# EAGLE design HM_EX_DS18B20 (EAGLE 9.2.2)
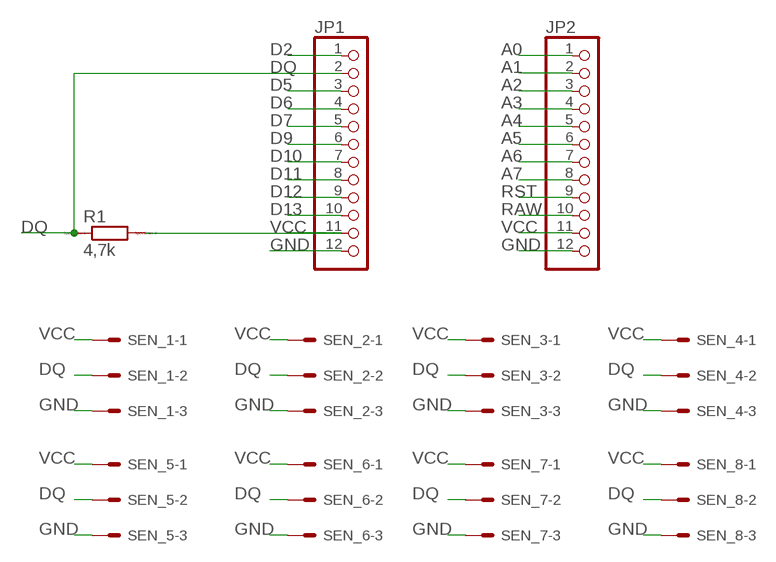
[diagram p0: schematic, sheet 1]

## Parts
JP1  PINHD-1X12  [1X12]
JP2  PINHD-1X12  [1X12]
R1  4,7k  R0207/10  [0207/10]
SEN_1  22-27-2031-03  [6410-03]
SEN_2  22-27-2031-03  [6410-03]
SEN_3  22-27-2031-03  [6410-03]
SEN_4  22-27-2031-03  [6410-03]
SEN_5  22-27-2031-03  [6410-03]
SEN_6  22-27-2031-03  [6410-03]
SEN_7  22-27-2031-03  [6410-03]
SEN_8  22-27-2031-03  [6410-03]

## Nets
A0: JP2.1
A1: JP2.2
A2: JP2.3
A3: JP2.4
A4: JP2.5
A5: JP2.6
A6: JP2.7
A7: JP2.8
D2: JP1.1
D5: JP1.3
D6: JP1.4
D7: JP1.5
D9: JP1.6
D10: JP1.7
D11: JP1.8
D12: JP1.9
D13: JP1.10
DQ: JP1.2 R1.1 SEN_1.2 SEN_2.2 SEN_3.2 SEN_4.2 SEN_5.2 SEN_6.2 SEN_7.2 SEN_8.2
GND: JP1.12 JP2.12 SEN_1.3 SEN_2.3 SEN_3.3 SEN_4.3 SEN_5.3 SEN_6.3 SEN_7.3 SEN_8.3
RAW: JP2.10
RST: JP2.9
VCC: JP1.11 JP2.11 R1.2 SEN_1.1 SEN_2.1 SEN_3.1 SEN_4.1 SEN_5.1 SEN_6.1 SEN_7.1 SEN_8.1

## Library data of the parts
JP1 JP2 = adafruit:PINHD-1X12: PIN HEADER
R1 = eagle-ltspice:R: RESISTOR, European symbol; SPICEMODEL: NONE; SPICEPREFIX: R
SEN_1-SEN_8 = con-molex:22-?-03: CONNECTOR wire to board 2.54 mm (.1 inch) pitch header; MF: MOLEX; OC_FARNELL: unknown; OC_NEWARK: unknown

## Board
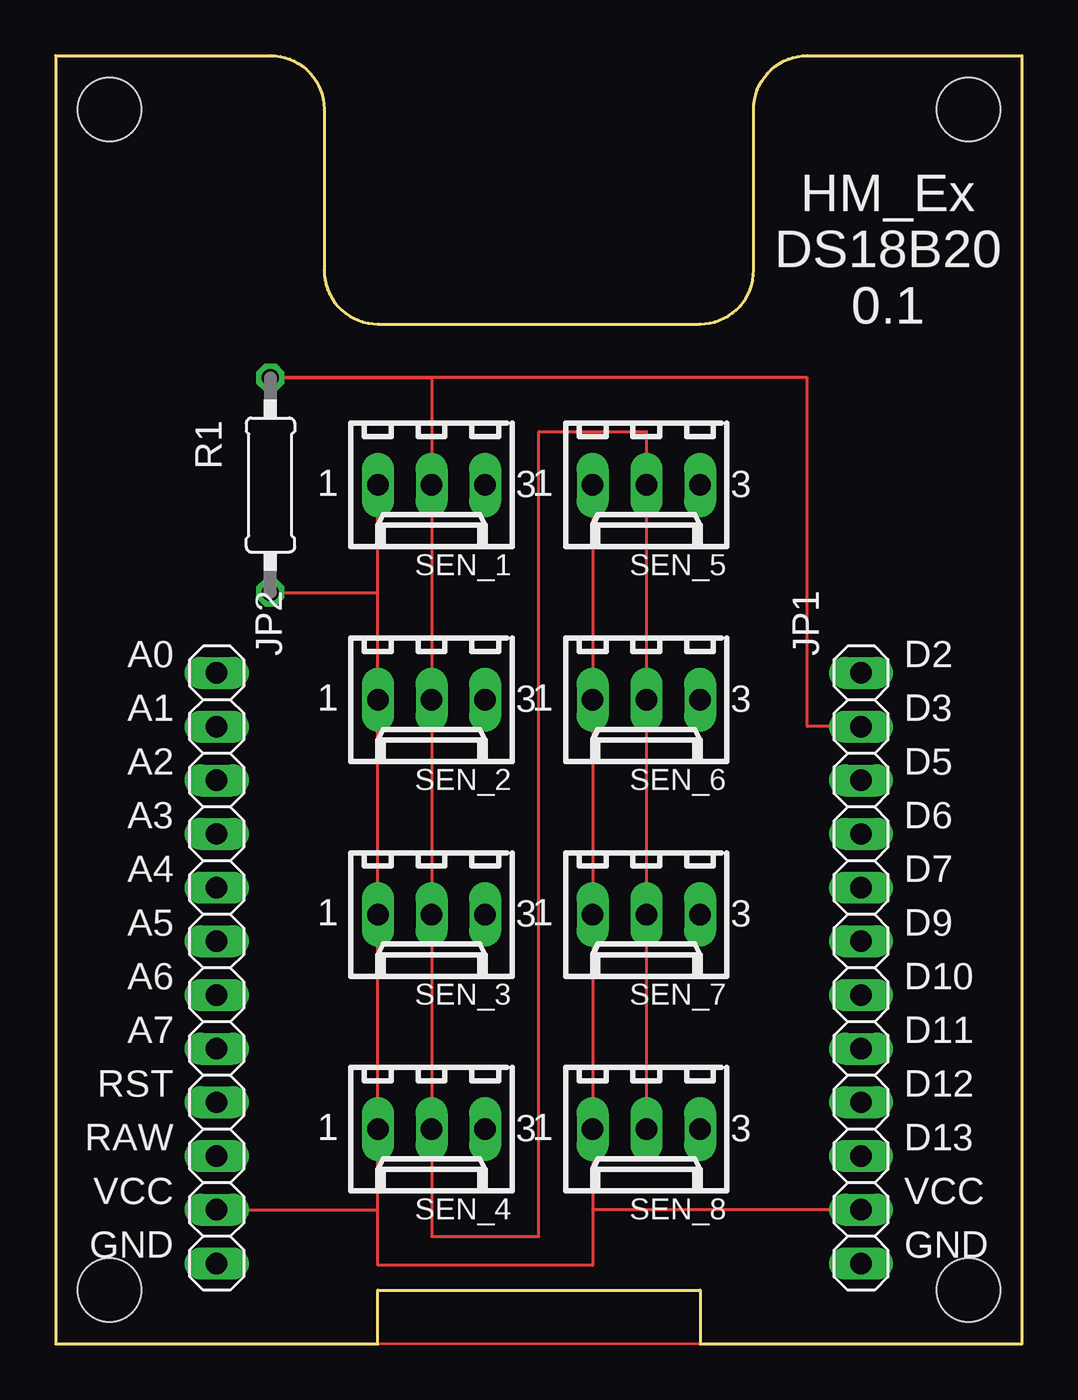
[diagram p1: board, top side]
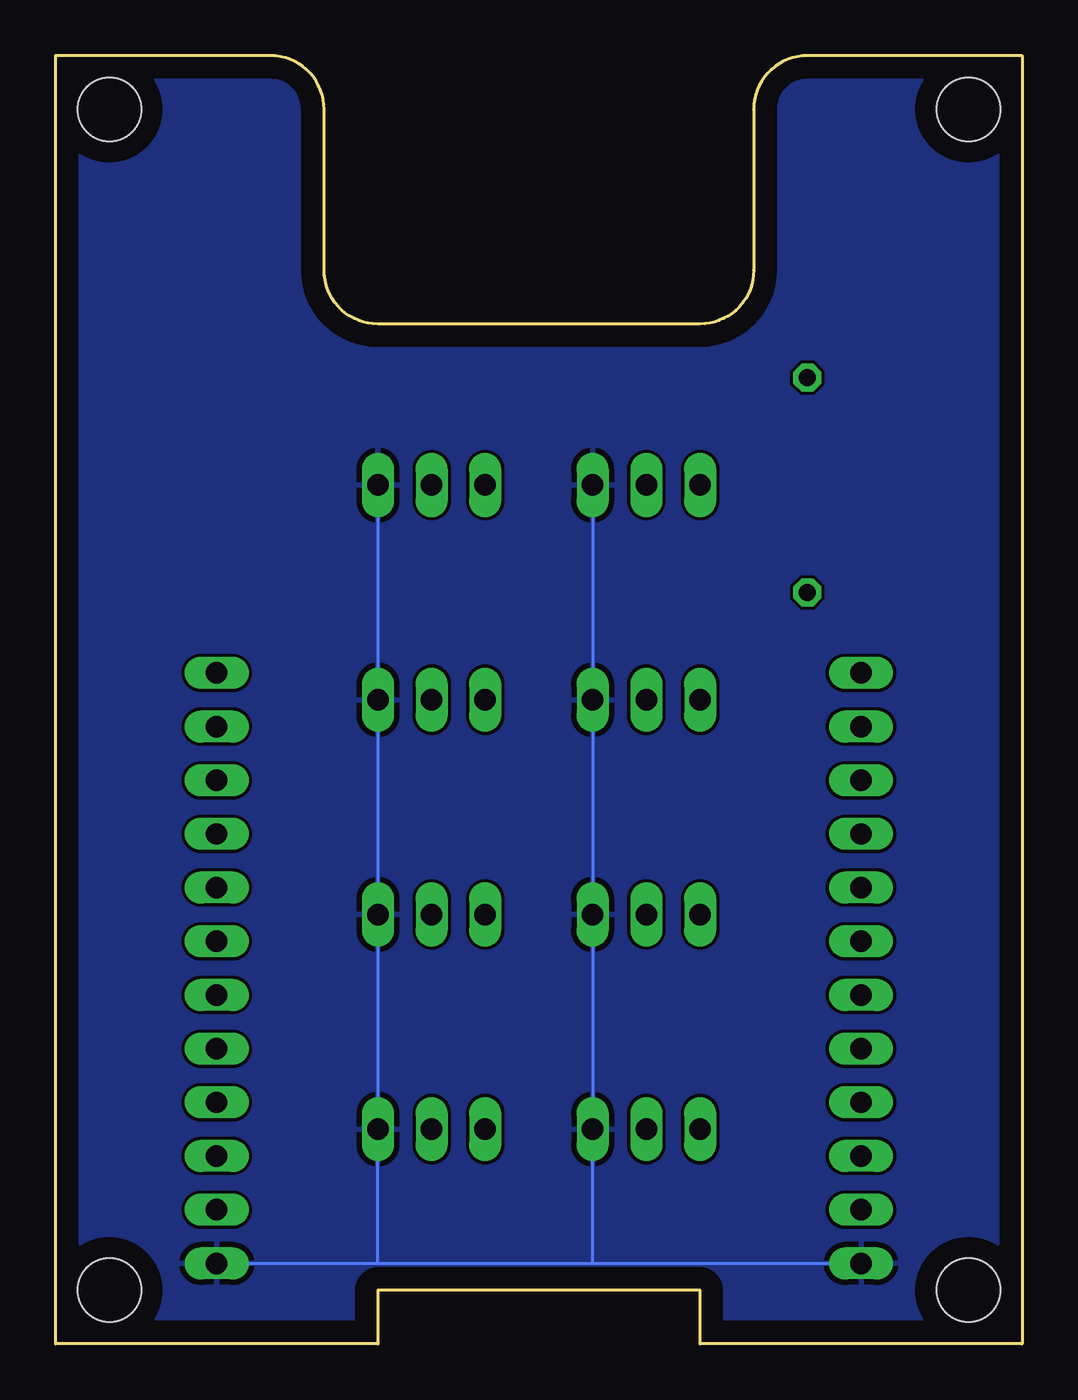
[diagram p2: board, bottom side, seen from below]

Size 45.72 x 60.96 mm. Coordinates in mm from the lower left corner, seen from the top.
Outline: 12.7,0 15.24,0
Outline: 15.24,0 0,0 0,60.96 10.16,60.96 arc-90 12.7,58.42 12.7,50.8 arc90 15.24,48.26 30.48,48.26 arc90 33.02,50.8 33.02,58.42 arc-90 35.56,60.96 45.72,60.96 45.72,0 30.48,0 30.48,2.54 15.24,2.54 15.24,0
Copper layers (1*16): Top 0.035mm / dielectric 1.5mm / Bottom 0.035mm
Design rules "default": minimum track width 6mil, minimum drill 0.35mm, track to track 6mil, track to pad 6mil, pad to pad 6mil, via to via 6mil, smd to smd 6mil, copper to edge 40mil, drill to drill 6mil, minimum pad ring 10mil, minimum via ring 8mil, stop-mask expansion 4mil, vias tented up to drill 0mil, thermal gap 10mil
Holes 3 mm at 2.54,2.54 2.54,58.42 43.18,2.54 43.18,58.42

### Footprints (pad centres in the part's own frame; a part is rotated, then mirrored left to right if it is on the bottom)
1X12 = drill 1.016 long: 1 -13.97,0; 2 -11.43,0; 3 -8.89,0; 4 -6.35,0; 5 -3.81,0; 6 -1.27,0; 7 1.27,0; 8 3.81,0; 9 6.35,0; 10 8.89,0; 11 11.43,0; 12 13.97,0
0207/10 = drill 0.813 octagon: 1 -5.08,0; 2 5.08,0
6410-03 = drill 1.016 long: 1 2.54,0; 2 0,0; 3 -2.54,0

### Placement (x,y rotation side)
JP1  38.1,17.78 270 top
JP2  7.62,17.78 270 top
R1  10.16,40.64 270 top
SEN_1  17.78,40.64 180 top
SEN_2  17.78,30.48 180 top
SEN_3  17.78,20.32 180 top
SEN_4  17.78,10.16 180 top
SEN_5  27.94,40.64 180 top
SEN_6  27.94,30.48 180 top
SEN_7  27.94,20.32 180 top
SEN_8  27.94,10.16 180 top

### Tracks (layer width: path | path; a pad name or v marks a point on that pad's centre or on a via)
DQ
  Top 0.152: JP1.2 35.56,29.21 35.56,45.72 R1.1 17.78,45.72 SEN_1.2 SEN_2.2 SEN_3.2 SEN_4.2 17.78,5.08 22.86,5.08 22.86,43.18 27.94,43.18 SEN_5.2 SEN_6.2 SEN_7.2 SEN_8.2
GND
  Bottom 0.152: SEN_5.3 SEN_6.3 SEN_7.3 SEN_8.3 30.48,3.81 | SEN_1.3 SEN_2.3 SEN_3.3 SEN_4.3 20.32,3.81 | JP1.12 30.48,3.81 | 30.48,3.81 20.32,3.81 | 20.32,3.81 JP2.12
  pour Bottom: 45.72,60.96 45.72,0 30.48,0 30.48,2.54 15.24,2.54 15.24,0 0,0 0,60.96 10.16,60.96 12.7,58.42 12.7,50.8 12.7,48.26 33.02,48.26 33.02,58.42 35.56,60.96
VCC
  Top 0.152: JP2.11 15.24,6.35 | 15.24,6.35 SEN_4.1 SEN_3.1 SEN_2.1 SEN_1.1 15.24,35.56 R1.2 | SEN_5.1 SEN_6.1 SEN_7.1 SEN_8.1 25.4,6.35 | 25.4,6.35 25.4,3.71 15.24,3.71 15.24,6.35 | JP1.11 25.4,6.35
(copper drawn outside any net)
  shapes: Top area x2

### Text on the board
tNames: HM_Ex / DS18B20 / 0.1 | A0 | D2 | A1 | D3 | A2 | D5 | A3 | D6 | A4 | D7 | A5 | D9 | A6 | D10 | A7 | D11 | RST | D12 | RAW | D13 | VCC | VCC | GND | GND